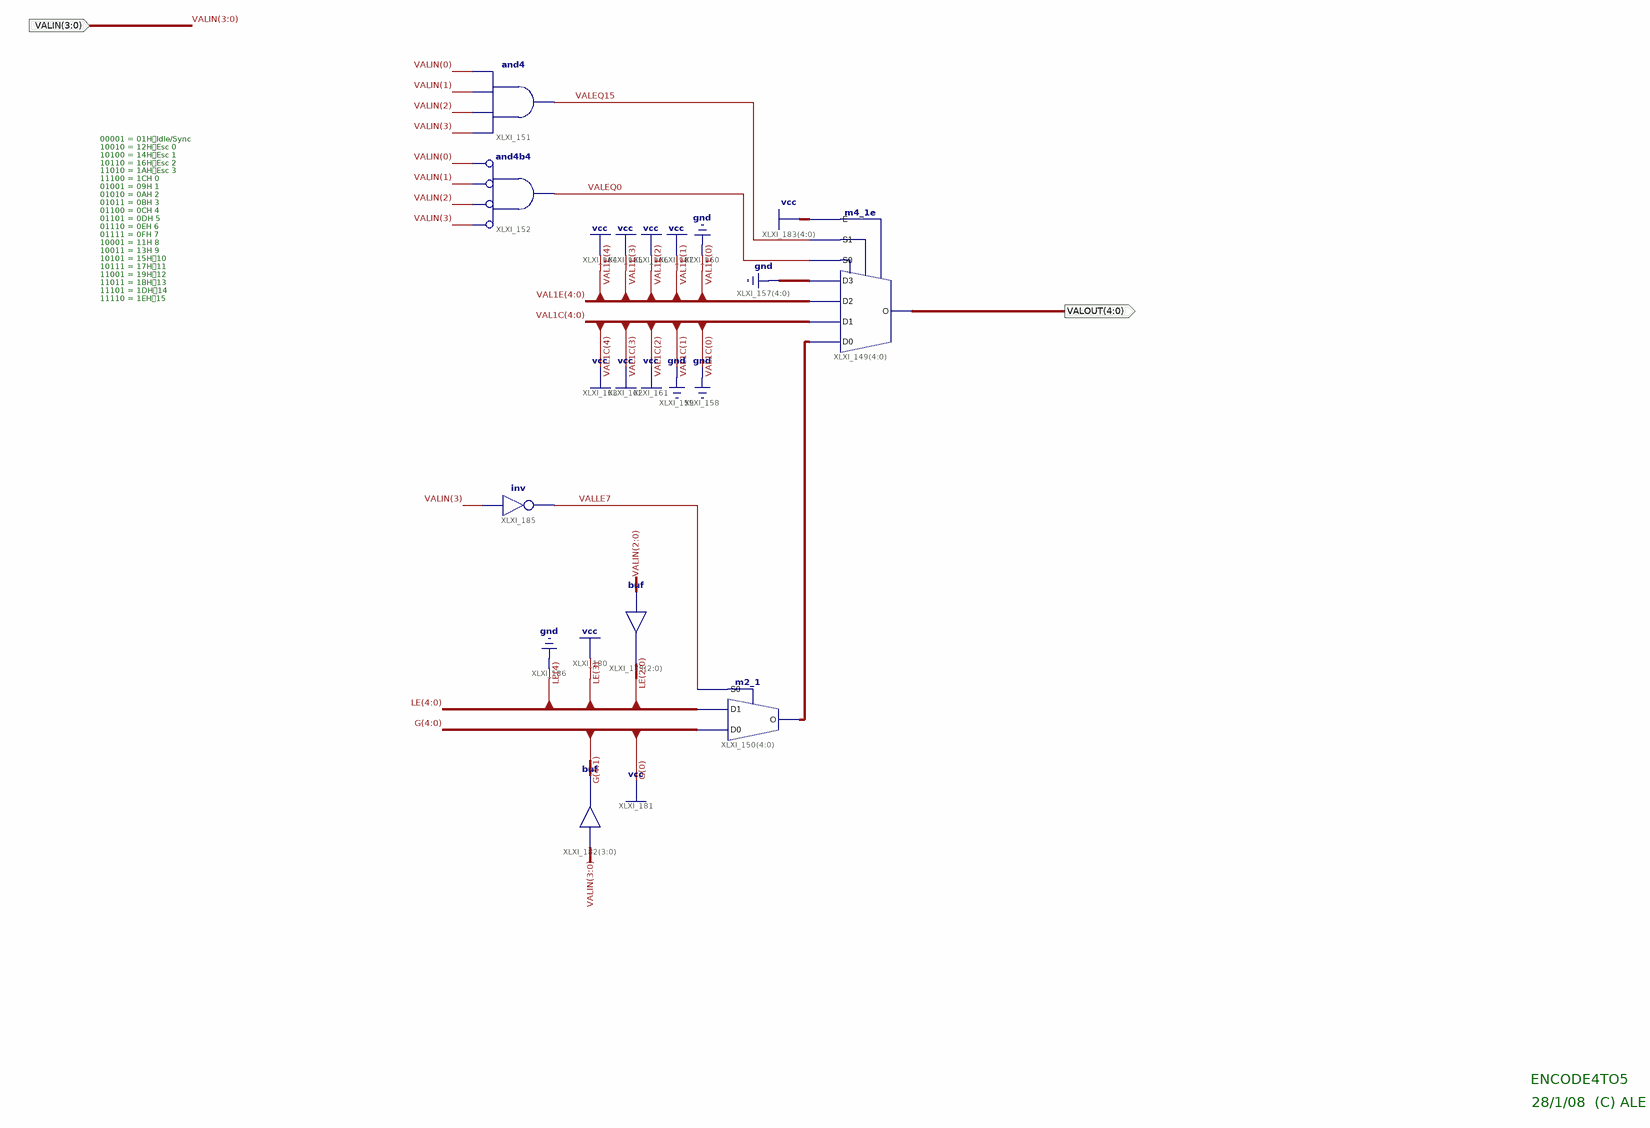
[diagram p0: schematic sheet 1]
// Xilinx ISE schematic Encode4to5.sch (spartan6) as structural Verilog: 7 symbols, 3 ports
module Encode4to5 (
  input  [3:0] VALIN,
  output [4:0] VALOUT
);

  wire VALEQ0, VALEQ15, VALLE7;
  wire [2:0] LE;
  wire [4:0] XLXN_298;
  wire [4:1] G;

  and XLXI_152 (VALEQ0, ~VALIN[3], ~VALIN[2], ~VALIN[1], ~VALIN[0]);  // and4b4
  m4_1e XLXI_149[4:0] (
    .D0(XLXN_298), .D1(5'b11100), .D2(5'b11110), .D3({5{1'b0}}), .E({5{1'b1}}), .S0(VALEQ0), .S1(VALEQ15),
    .O(VALOUT));
  and XLXI_151 (VALEQ15, VALIN[3], VALIN[2], VALIN[1], VALIN[0]);
  m2_1 XLXI_150[4:0] (.D0({G, 1'b1}), .D1({2'b01, LE}), .S0(VALLE7), .O(XLXN_298));
  assign LE = VALIN[2:0];  // buf XLXI_179[2..0], 3 bits wide
  assign G = VALIN;  // buf XLXI_182[3..0], 4 bits wide
  not XLXI_185 (VALLE7, VALIN[3]);

  // Notes on the sheet:
  //   00001 = 01H	Idle/Sync
  //   10010 = 12H	Esc 0
  //   10100 = 14H	Esc 1
  //   10110 = 16H	Esc 2
  //   11010 = 1AH	Esc 3
  //   11100 = 1CH 0
  //   01001 = 09H 1
  //   01010 = 0AH 2
  //   01011 = 0BH 3
  //   01100 = 0CH 4
  //   01101 = 0DH 5
  //   01110 = 0EH 6
  //   01111 = 0FH 7
  //   10001 = 11H 8
  //   10011 = 13H 9
  //   10101 = 15H	10
  //   10111 = 17H	11
  //   11001 = 19H	12
  //   11011 = 1BH	13
  //   11101 = 1DH	14
  //   11110 = 1EH	15
  //   ENCODE4TO5
  //   28/1/08  (C) ALE
endmodule
